# EAGLE design ekg-aio (EAGLE 5.10)
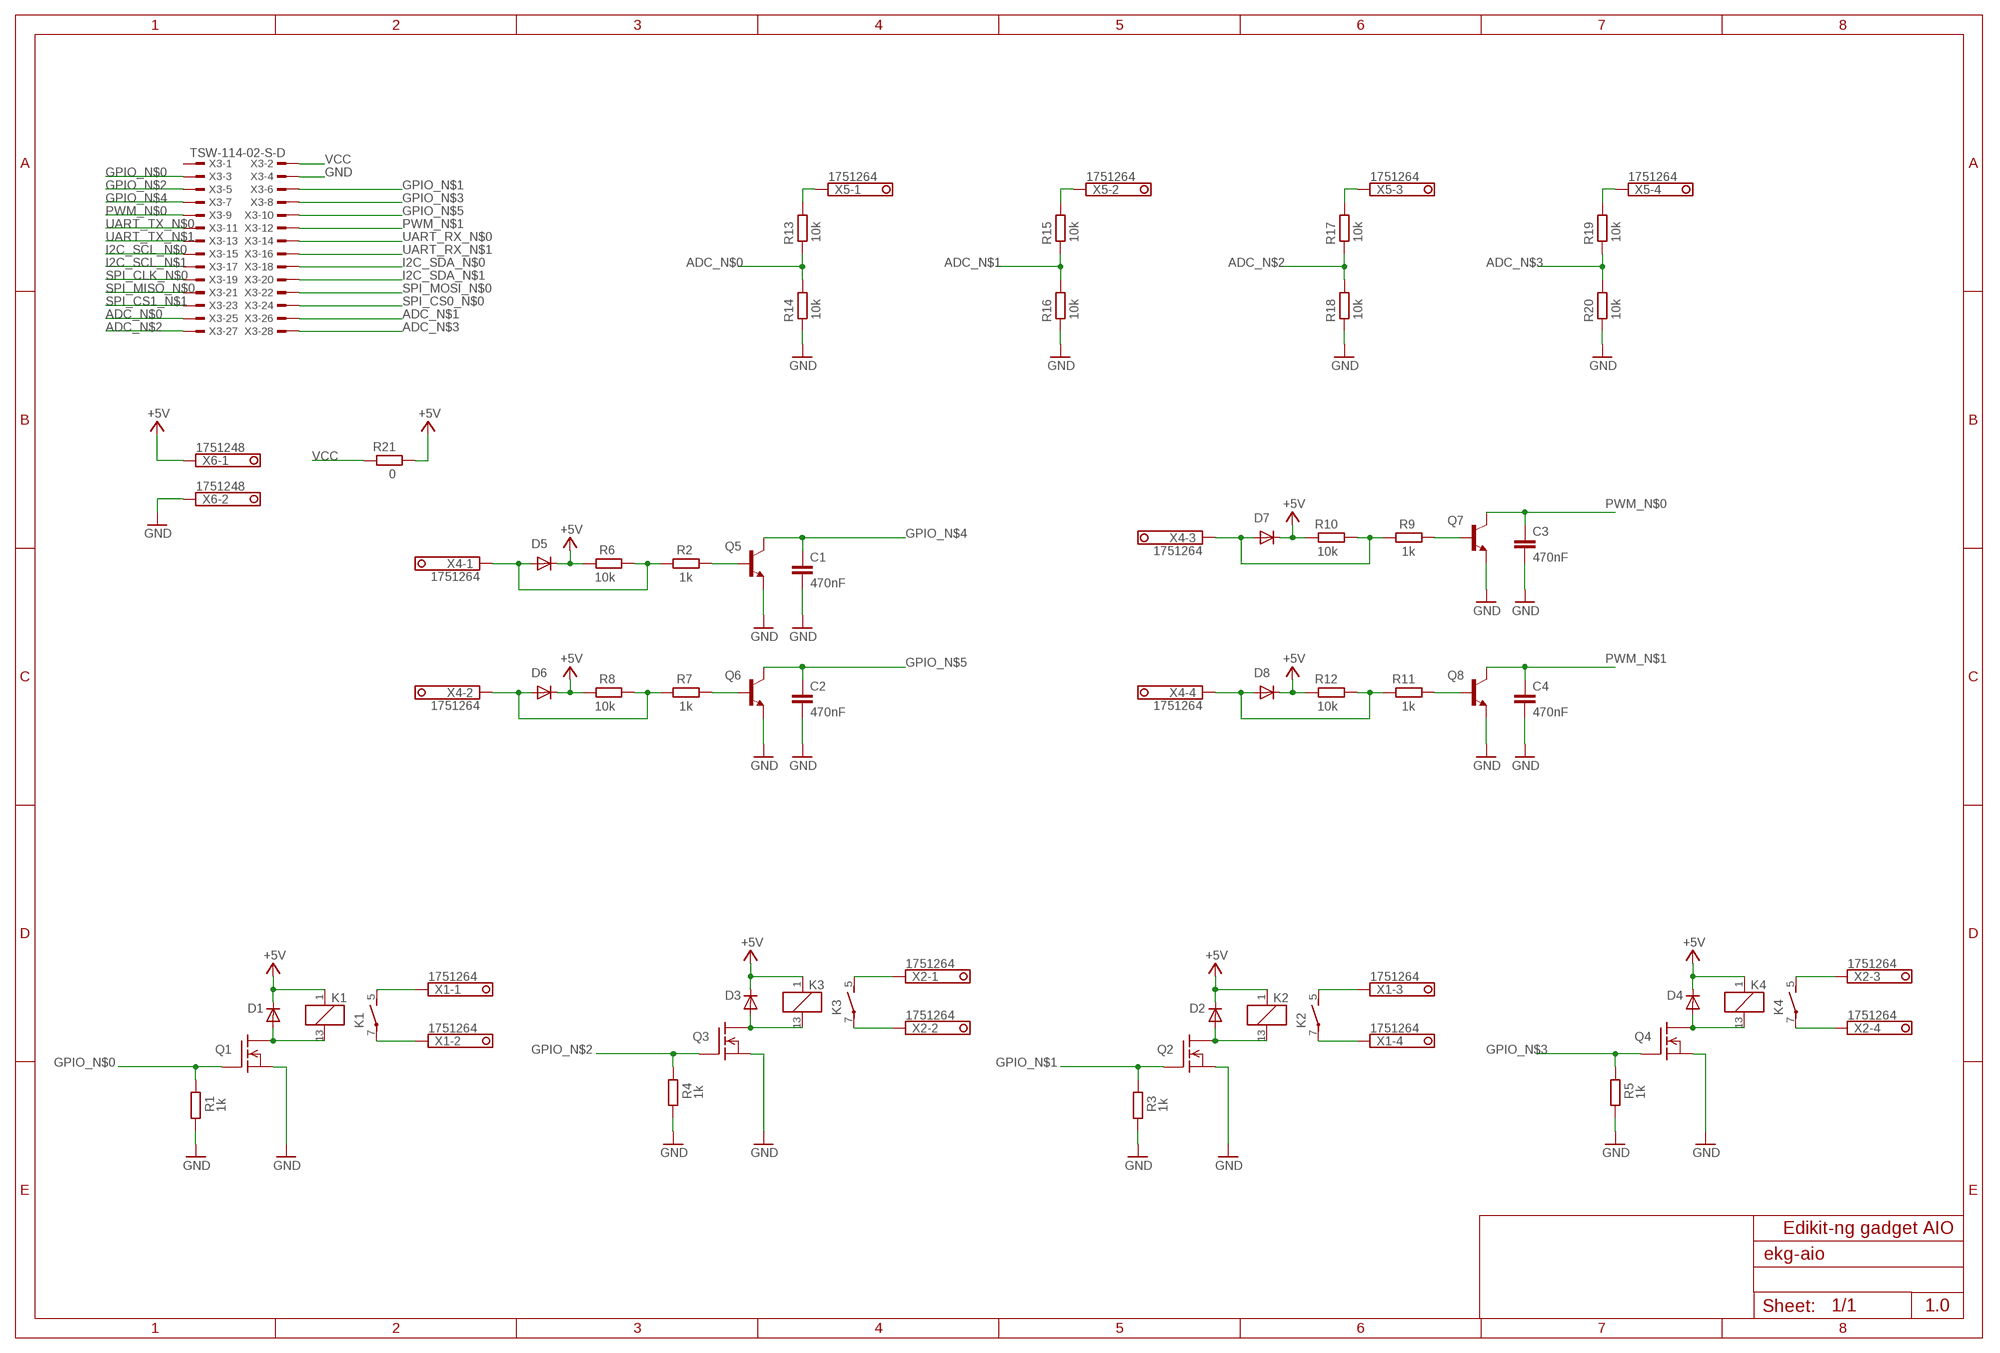
[diagram p0: schematic, sheet 1]

## Parts
C1  470nF  C-EUC0805  [C0805]
C2  470nF  C-EUC0805  [C0805]
C3  470nF  C-EUC0805  [C0805]
C4  470nF  C-EUC0805  [C0805]
D1  1N41480805  [0805]
D2  1N41480805  [0805]
D3  1N41480805  [0805]
D4  1N41480805  [0805]
D5  1N41480805  [0805]
D6  1N41480805  [0805]
D7  1N41480805  [0805]
D8  1N41480805  [0805]
K1  G6D-04P  [G6D-1A]
K2  G6D-04P  [G6D-1A]
K3  G6D-04P  [G6D-1A]
K4  G6D-04P  [G6D-1A]
Q1  BSS138  [SOT23]
Q2  BSS138  [SOT23]
Q3  BSS138  [SOT23]
Q4  BSS138  [SOT23]
Q5  BC817-40SMD  [SOT23-BEC]
Q6  BC817-40SMD  [SOT23-BEC]
Q7  BC817-40SMD  [SOT23-BEC]
Q8  BC817-40SMD  [SOT23-BEC]
R1  1k  R-EU_R1206  [R1206]
R2  1k  R-EU_R1206  [R1206]
R3  1k  R-EU_R1206  [R1206]
R4  1k  R-EU_R1206  [R1206]
R5  1k  R-EU_R1206  [R1206]
R6  10k  R-EU_R1206  [R1206]
R7  1k  R-EU_R1206  [R1206]
R8  10k  R-EU_R1206  [R1206]
R9  1k  R-EU_R1206  [R1206]
R10  10k  R-EU_R1206  [R1206]
R11  1k  R-EU_R1206  [R1206]
R12  10k  R-EU_R1206  [R1206]
R13  10k  R-EU_R1206  [R1206]
R14  10k  R-EU_R1206  [R1206]
R15  10k  R-EU_R1206  [R1206]
R16  10k  R-EU_R1206  [R1206]
R17  10k  R-EU_R1206  [R1206]
R18  10k  R-EU_R1206  [R1206]
R19  10k  R-EU_R1206  [R1206]
R20  10k  R-EU_R1206  [R1206]
R21  0  R-EU_R1206  [R1206]
X1  1751264  [1751264]
X2  1751264  [1751264]
X3  TSW-114-02-S-D  [TSW-114-02-S-D]
X4  1751264  [1751264]
X5  1751264  [1751264]
X6  1751248  [1751248]

## Nets
+5V: D1.2(C) D2.2(C) D3.2(C) D4.2(C) D5.2(C) D6.2(C) D7.2(C) D8.2(C) K1.1 K2.1 K3.1 K4.1 R6.2 R8.2 R10.2 R12.2 R21.1 X6.1
ADC_N$0: R13.2 R14.1 X3.25
ADC_N$1: R15.2 R16.1 X3.26
ADC_N$2: R17.2 R18.1 X3.27
ADC_N$3: R19.2 R20.1 X3.28
GND: C1.2 C2.2 C3.2 C4.2 Q1.2(S) Q2.2(S) Q3.2(S) Q4.2(S) Q5.E Q6.E Q7.E Q8.E R1.1 R3.1 R4.1 R5.1 R14.2 R16.2 R18.2 R20.2 X3.4 X6.2
GPIO_N$0: Q1.1(G) R1.2 X3.3
GPIO_N$1: Q2.1(G) R3.2 X3.6
GPIO_N$2: Q3.1(G) R4.2 X3.5
GPIO_N$3: Q4.1(G) R5.2 X3.8
GPIO_N$4: C1.1 Q5.C X3.7
GPIO_N$5: C2.1 Q6.C X3.10
I2C_SCL_N$0: X3.15
I2C_SCL_N$1: X3.17
I2C_SDA_N$0: X3.18
I2C_SDA_N$1: X3.20
N$1: Q5.B R2.1
N$2: D1.1(A) K1.13 Q1.3(D)
N$3: Q6.B R7.1
N$4: D2.1(A) K2.13 Q2.3(D)
N$5: K1.5(2:S) X1.1
N$6: K1.7(2:P) X1.2
N$7: K2.5(2:S) X1.3
N$8: K2.7(2:P) X1.4
N$9: Q7.B R9.1
N$10: D3.1(A) K3.13 Q3.3(D)
N$11: K3.5(2:S) X2.1
N$12: K3.7(2:P) X2.2
N$13: D7.1(A) R9.2 R10.1 X4.3
N$14: D4.1(A) K4.13 Q4.3(D)
N$15: K4.5(2:S) X2.3
N$16: K4.7(2:P) X2.4
N$17: Q8.B R11.1
N$18: D8.1(A) R11.2 R12.1 X4.4
N$19: D5.1(A) R2.2 R6.1 X4.1
N$20: D6.1(A) R7.2 R8.1 X4.2
N$21: R13.1 X5.1
N$22: R15.1 X5.2
N$23: R17.1 X5.3
N$24: R19.1 X5.4
PWM_N$0: C3.1 Q7.C X3.9
PWM_N$1: C4.1 Q8.C X3.12
SPI_CLK_N$0: X3.19
SPI_CS0_N$0: X3.24
SPI_CS1_N$1: X3.23
SPI_MISO_N$0: X3.21
SPI_MOSI_N$0: X3.22
UART_RX_N$0: X3.14
UART_RX_N$1: X3.16
UART_TX_N$0: X3.11
UART_TX_N$1: X3.13
VCC: R21.2 X3.2
Unconnected: X3.1

## Notes on the sheet
- Edikit-ng gadget AIO
- 1.0

## Library data of the parts
C1-C4 = resistor:C-EU: CAPACITOR, European symbol
D1-D8 = design:1N4148: DIODE high speed (Philips)
K1-K4 = design:G6D?*: OMRON Slim, Miniature PCB Relay 20 × 5.08 × 12.5 mm
Q1-Q4 = design:BSS138: N-Channel Enhancement MOSFET 50V; 0,22A
Q5-Q8 = transistor-npn:BC817*: NPN Transistor
R1-R21 = resistor:R-EU_: RESISTOR, European symbol
X1 X2 X4 X5 = con-phoenix-350:1751264: MKDS 1/ 4-3,5 Printklemme Nennstrom: 10 A Bemessungsspannung: 160 V Raster: 3,5 mm Polzahl: 4 Montageart: Löten Anschlussart: Schraubanschluss Anschlussrichtung vom Leiter zur Platine: 0° Source: http://eshop.phoenixcontact.com .. 1751264.pdf
X3 = con-samtec:TSW-114-02-S-D: THROUGH-HOLE .025" SQ POST HEADER Source: Samtec TSW.pdf
X6 = con-phoenix-350:1751248: MKDS 1/ 2-3,5 Printklemme Nennstrom: 10 A Bemessungsspannung: 160 V Raster: 3,5 mm Polzahl: 2 Montageart: Löten Anschlussart: Schraubanschluss Anschlussrichtung vom Leiter zur Platine: 0° Source: http://eshop.phoenixcontact.com .. 1751248.pdf

## Board
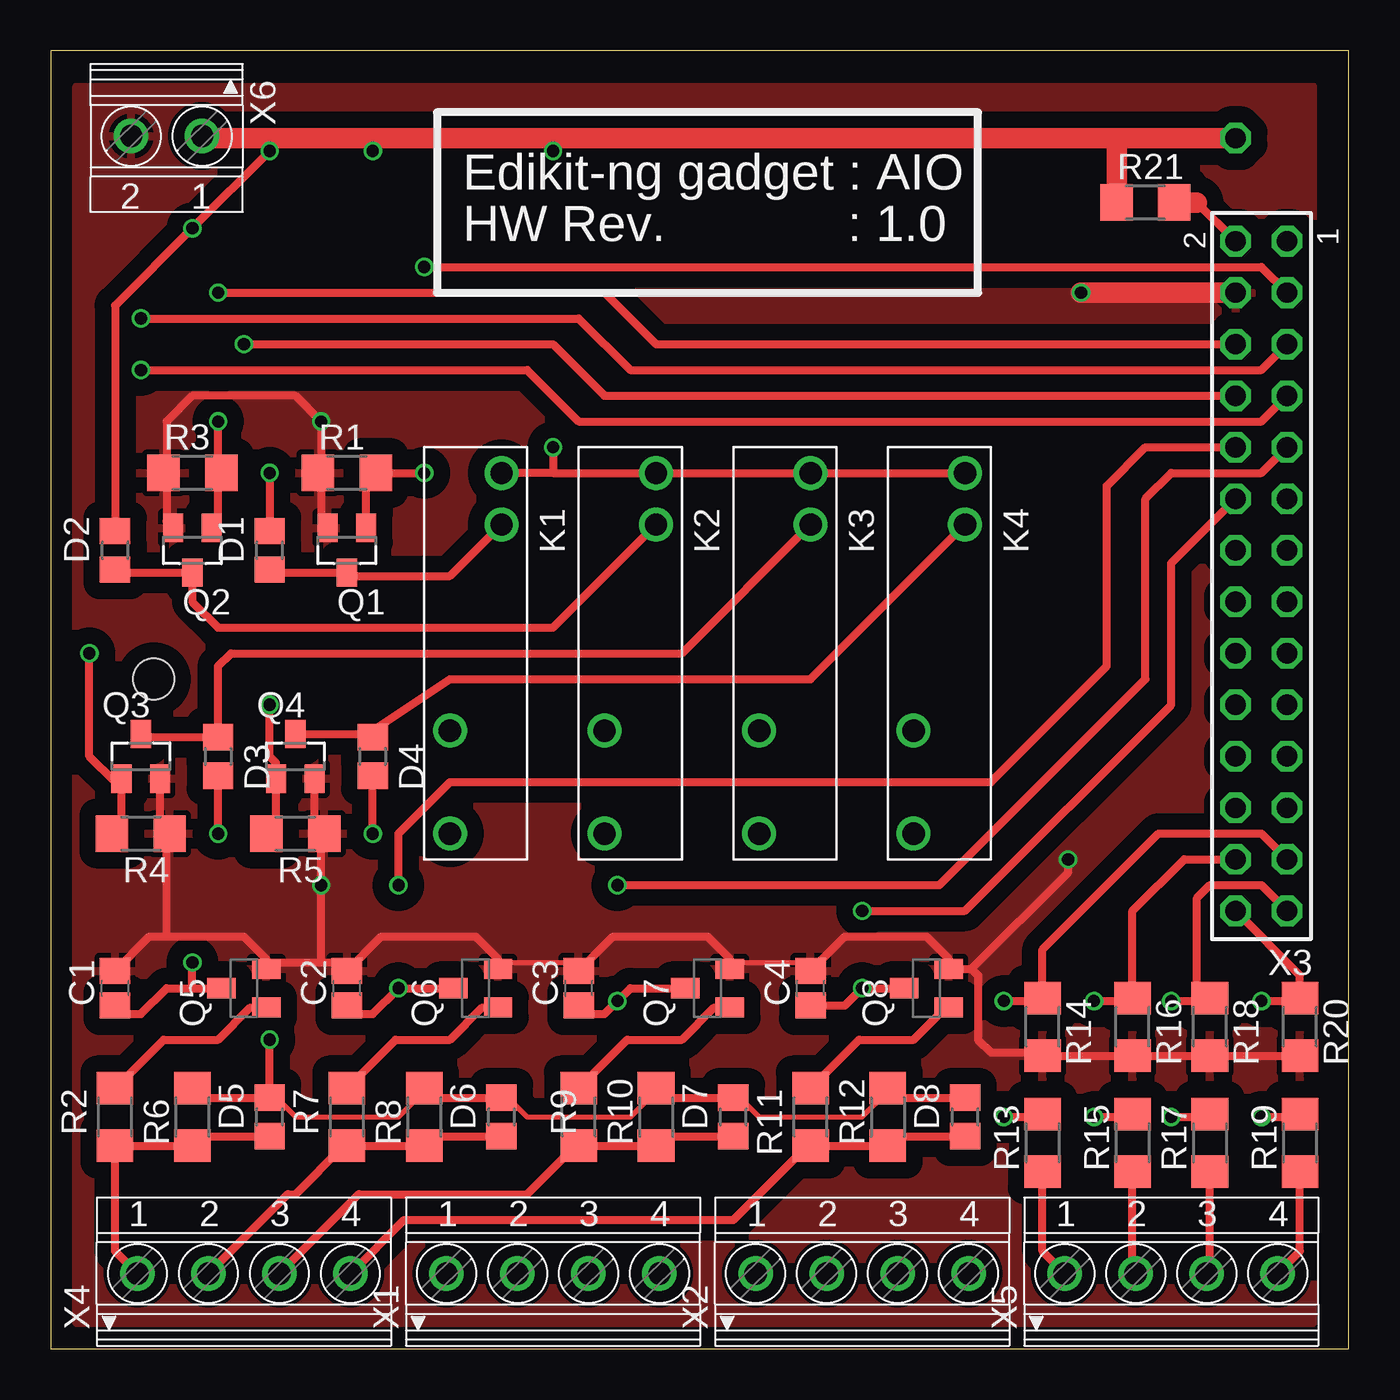
[diagram p1: board, top side]
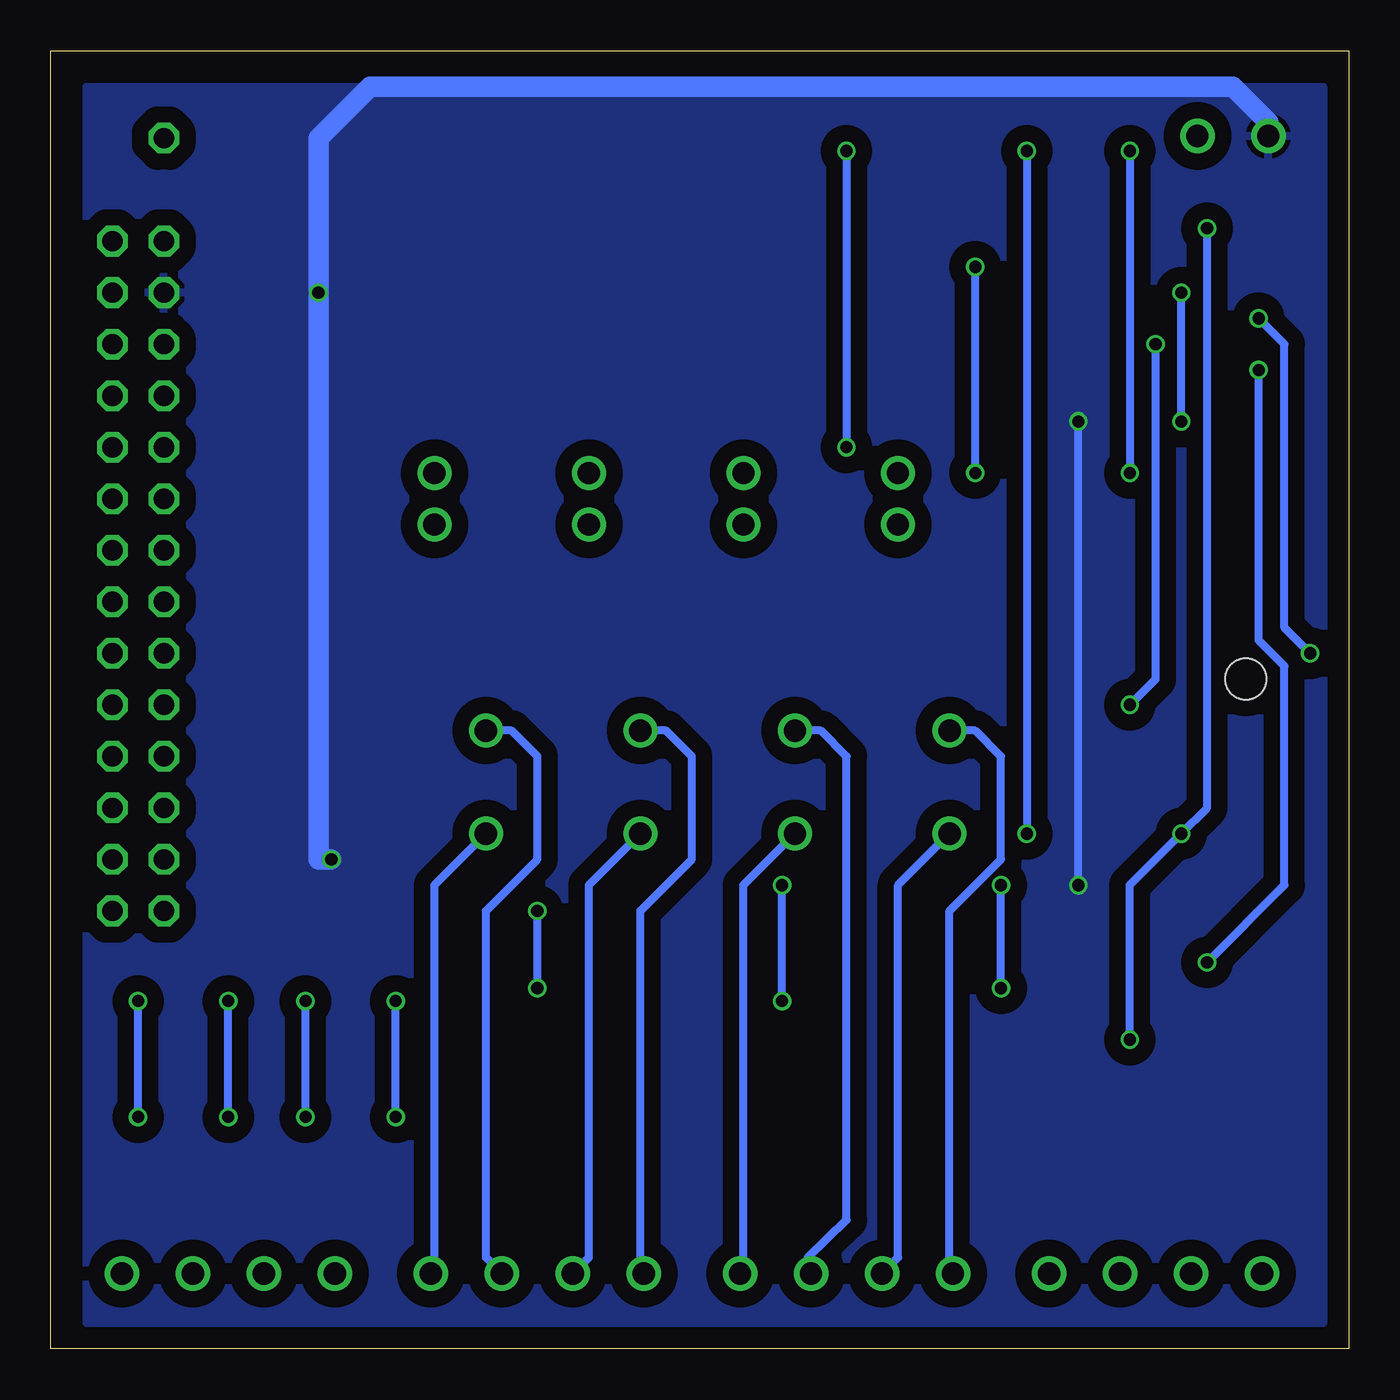
[diagram p2: board, bottom side, seen from below]

Size 64 x 64 mm. Coordinates in mm from the lower left corner, seen from the top.
Outline: 0,0 64,0 64,64 0,64 0,0
Copper layers (1*16): Top 0.035mm / dielectric 1.5mm / Bottom 0.035mm
Design rules "ITeadStudio": minimum track width 6mil, minimum drill 12mil, track to track 6mil, track to pad 6mil, pad to pad 6mil, via to via 6mil, smd to smd 0mil, copper to edge 10mil, drill to drill 10mil, minimum pad ring 10mil, minimum via ring 6mil, stop-mask expansion 2mil, vias tented up to drill 100mil, thermal gap 10mil
Holes 2 mm at 5.08,33.02

### Footprints (pad centres in the part's own frame; a part is rotated, then mirrored left to right if it is on the bottom)
C0805 = smd 1.3 x 1.5: 1 -0.85,0; 2 0.85,0
0805 = smd 1.3 x 1.5: 1 -0.95,0; 2 0.95,0
G6D-1A = drill 1.1 pad 1.676 round: 1 -8.89,1.27; 5 3.81,-1.27; 7 8.89,-1.27; 13 -6.35,1.27
SOT23 = smd 1 x 1.4: 1 -0.95,-1.1; 2 0.95,-1.1; 3 0,1.1
SOT23-BEC = smd 1 x 1.4: B -0.95,-1.1; C 0,1.1; E 0.95,-1.1
R1206 = smd 1.6 x 1.803: 1 -1.422,0; 2 1.422,0
1751264 = drill 1.1 pad 1.7 round: 1 -5.25,-0.1; 2 -1.75,-0.1; 3 1.75,-0.1; 4 5.25,-0.1
TSW-114-02-S-D = drill 1 pad 1.5 octagon: 1 16.51,-1.27; 2 16.51,1.27; 3 13.97,-1.27; 4 13.97,1.27; 5 11.43,-1.27; 6 11.43,1.27; 7 8.89,-1.27; 8 8.89,1.27; 9 6.35,-1.27; 10 6.35,1.27; 11 3.81,-1.27; 12 3.81,1.27; 13 1.27,-1.27; 14 1.27,1.27; 15 -1.27,-1.27; 16 -1.27,1.27; 17 -3.81,-1.27; 18 -3.81,1.27; 19 -6.35,-1.27; 20 -6.35,1.27; 21 -8.89,-1.27; 22 -8.89,1.27; 23 -11.43,-1.27; 24 -11.43,1.27; 25 -13.97,-1.27; 26 -13.97,1.27; 27 -16.51,-1.27; 28 -16.51,1.27
1751248 = drill 1.1 pad 1.7 round: 1 -1.75,-0.1; 2 1.75,-0.1

### Placement (x,y rotation side)
C1  3.17,17.78 90 top
C2  14.61,17.78 90 top
C3  26.04,17.78 90 top
C4  37.47,17.78 90 top
D1  10.79,39.37 90 top
D2  3.17,39.37 90 top
D3  8.26,29.21 270 top
D4  15.88,29.21 270 top
D5  10.79,11.43 90 top
D6  22.23,11.43 90 top
D7  33.66,11.43 90 top
D8  45.09,11.43 90 top
K1  20.95,34.29 270 top
K2  28.57,34.29 270 top
K3  36.2,34.29 270 top
K4  43.81,34.29 270 top
Q1  14.61,39.37 180 top
Q2  6.99,39.37 180 top
Q3  4.45,29.21 0 top
Q4  12.06,29.21 0 top
Q5  9.53,17.78 90 top
Q6  20.95,17.78 90 top
Q7  32.38,17.78 90 top
Q8  43.18,17.78 90 top
R1  14.61,43.18 0 top
R2  3.17,11.43 270 top
R3  6.99,43.18 0 top
R4  4.45,25.4 180 top
R5  12.06,25.4 180 top
R6  6.99,11.43 90 top
R7  14.61,11.43 270 top
R8  18.41,11.43 90 top
R9  26.04,11.43 270 top
R10  29.84,11.43 90 top
R11  37.47,11.43 270 top
R12  41.27,11.43 90 top
R13  48.9,10.16 90 top
R14  48.9,15.88 270 top
R15  53.34,10.16 90 top
R16  53.34,15.88 270 top
R17  57.15,10.16 90 top
R18  57.15,15.88 270 top
R19  61.59,10.16 90 top
R20  61.59,15.88 270 top
R21  53.98,56.52 0 top
X1  24.77,3.81 0 top
X2  40.01,3.81 0 top
X3  59.69,38.1 90 top
X4  9.53,3.81 0 top
X5  55.24,3.81 0 top
X6  5.71,59.69 180 top

### Tracks (layer width: path | path; a pad name or v marks a point on that pad's centre or on a via)
+5V  (via drill 0.6, 1)
  Top 0.254: D5.2 10.79,12.7 12.06,11.43 17.14,11.43 18.41,12.7 R8.2 | D7.2 33.66,12.7 34.92,11.43 40.01,11.43 41.27,12.7 R12.2 | D6.2 22.23,12.7 23.5,11.43 28.57,11.43 29.84,12.7 R10.2
  Top 0.406: R6.2 7.46,12.38 D5.2 v10.79,15.24 | D6.2 18.89,12.38 R8.2 | D7.2 30.32,12.38 R10.2 | D8.2 41.75,12.38 R12.2 | 24.77,43.18 K2.1 K3.1 K4.1 | v10.79,43.18 D1.2 | 10.79,59.69 v10.79,59.05 v6.99,55.24 3.17,51.44 D2.2 | 24.77,43.18 K1.1 | v24.77,44.45 24.77,43.18 | 24.77,59.69 v24.77,59.05 | v8.26,25.4 D3.2 | v15.88,25.4 D4.2 | 15.88,59.69 v15.88,59.05 | 52.07,59.69 52.55,59.21
  Top 1.016: X6.1 7.52,59.79 7.62,59.69 10.79,59.69 15.88,59.69 24.77,59.69 52.07,59.69 v58.42,59.69 | 52.55,59.21 R21.1
  Bottom 0.406: v10.79,59.05 v10.79,43.18 | v24.77,59.05 v24.77,44.45 | v6.99,55.24 6.99,26.67 v8.26,25.4 10.79,22.86 v10.79,15.24 | v15.88,59.05 v15.88,25.4
ADC_N$0  (via drill 0.6)
  Top 0.406: X3.25 59.69,25.4 54.61,25.4 48.9,19.68 R14.1 48.9,17.14 v46.99,17.14 | v46.99,11.43 48.74,11.43 R13.2
  Bottom 0.406: v46.99,11.43 v46.99,17.14
ADC_N$1  (via drill 0.6)
  Top 0.406: X3.26 55.88,24.13 53.34,21.59 R16.1 53.34,17.14 v51.44,17.14 | v51.44,11.43 53.19,11.43 R15.2
  Bottom 0.406: v51.44,11.43 v51.44,17.14
ADC_N$2  (via drill 0.6)
  Top 0.406: X3.27 59.69,22.86 57.15,22.86 56.52,22.23 56.52,17.93 R18.1 57.15,17.14 v55.24,17.14 | v55.24,11.43 57,11.43 R17.2
  Bottom 0.406: v55.24,11.43 v55.24,17.14
ADC_N$3  (via drill 0.6)
  Top 0.406: X3.28 61.59,18.41 R20.1 61.59,17.14 v59.69,17.14 | v59.69,11.43 61.44,11.43 R19.2
  Bottom 0.406: v59.69,11.43 v59.69,17.14
GND  (via drill 0.6)
  Top 0.254: 5.71,25.4 R4.1 | Q5.E 10.79,19.05 | 14.61,19.05 C2.2 | C3.2 26.04,19.05 22.23,19.05 Q6.E | Q7.E 33.66,19.05 37.47,19.05 C4.2
  Top 0.406: Q3.2 5.39,25.87 R4.1 | Q4.2 13.02,25.87 R5.1 13.34,25.4 v13.34,22.86 13.34,19.05 | Q5.E 10.62,19.22 9.53,20.32 5.71,20.32 | 5.71,20.32 4.87,20.32 C1.2 | Q6.E 22.05,19.22 20.95,20.32 16.3,20.32 C2.2 | Q7.E 33.48,19.22 32.38,20.32 27.73,20.32 C3.2 | C4.2 39.16,20.32 43.18,20.32 44.28,19.22 Q8.E 45.4,18.73 | 5.71,20.32 5.71,25.4 | 13.34,19.05 14.61,19.05 | 10.79,19.05 13.34,19.05 | 45.4,18.73 50.16,23.5 v50.16,24.13 | 13.34,43.18 13.34,40.79 Q1.2 | 5.71,43.18 5.71,40.79 Q2.2 | 5.71,43.18 R3.1 | 5.71,43.18 5.71,45.72 6.99,46.99 12.06,46.99 v13.34,45.72 13.34,43.18 | 13.34,43.18 R1.1 | R20.2 R18.2 R16.2 R14.2 48.41,14.45 48.26,14.61 46.35,14.61 45.72,15.24 45.72,18.41 45.41,18.73 45.4,18.73
  Top 1.016: v50.8,52.07 X3.4
  Bottom 0.406: v13.34,22.86 v13.34,45.72
  Bottom 1.016: v50.16,24.13 50.8,24.13 v50.8,52.07 50.8,59.69 48.26,62.23 5.71,62.23 3.96,60.48 X6.2
  pour Top (isolate 0.813): 1.27,62.23 62.23,62.23 62.23,1.27 1.27,1.27
  pour Bottom (isolate 0.813): 1.27,62.23 1.27,1.27 62.23,1.27 62.23,62.23
GPIO_N$0  (via drill 0.6)
  Top 0.406: Q1.1 15.55,42.71 R1.2 v18.41,43.18 | X3.3 59.69,53.34 v18.41,53.34
  Bottom 0.406: v18.41,43.18 v18.41,53.34
GPIO_N$1  (via drill 0.6)
  Top 0.406: Q2.1 7.93,40.64 8.26,40.64 8.26,43.18 R3.2 8.26,43.33 v8.26,45.72 | v8.26,52.07 27.3,52.07 29.84,49.53 X3.6
  Bottom 0.406: v8.26,45.72 v8.26,52.07
GPIO_N$2  (via drill 0.6)
  Top 0.406: R4.2 3.5,25.87 Q3.1 3.33,27.94 3.17,27.94 1.91,29.21 v1.91,34.29 | X3.5 59.69,48.26 28.57,48.26 26.04,50.8 v4.45,50.8
  Bottom 0.406: v4.45,50.8 3.17,49.53 3.17,35.56 v1.91,34.29
GPIO_N$3  (via drill 0.6)
  Top 0.406: R5.2 11.12,25.87 Q4.1 11.12,28.89 10.79,29.21 v10.79,31.75 | v9.53,49.53 24.77,49.53 27.3,46.99 X3.8
  Bottom 0.406: v10.79,31.75 9.53,33.02 v9.53,49.53
GPIO_N$4  (via drill 0.6)
  Top 0.406: 6.99,17.78 5.71,17.78 4.45,16.51 3.6,16.51 C1.1 | 6.99,17.78 Q5.C | X3.7 59.69,45.72 26.04,45.72 23.5,48.26 v4.45,48.26 | 6.99,17.78 v6.99,19.05
  Bottom 0.406: v6.99,19.05 3.17,22.86 3.17,33.66 4.45,34.92 v4.45,48.26
GPIO_N$5  (via drill 0.6)
  Top 0.406: Q6.C v17.14,17.78 15.88,16.51 15.03,16.51 C2.1 | X3.10 53.98,44.45 52.07,42.55 52.07,33.66 46.35,27.94 19.68,27.94 17.14,25.4 v17.14,22.86
  Bottom 0.406: v17.14,17.78 v17.14,22.86
N$1
  Top 0.406: Q5.B 9.85,16.83 8.26,15.24 5.56,15.24 R2.1
N$2
  Top 0.406: D1.1 10.79,38.27 Q1.3 14.61,38.1 19.68,38.1 K1.13
N$3
  Top 0.406: Q6.B 21.27,16.83 19.68,15.24 16.99,15.24 R7.1
N$4
  Top 0.406: D2.1 3.17,38.27 Q2.3 6.99,36.83 8.26,35.56 24.77,35.56 K2.13
N$5
  Bottom 0.406: K1.5 18.41,30.48 17.14,29.21 17.14,24.13 19.68,21.59 19.68,3.88 X1.1
N$6
  Bottom 0.406: K1.7 22.23,22.86 22.23,4.5 X1.2
N$7
  Bottom 0.406: K2.5 26.04,30.48 24.77,29.21 24.77,6.35 26.67,4.5 X1.3
N$8
  Bottom 0.406: K2.7 29.84,22.86 29.84,3.88 X1.4
N$9
  Top 0.406: Q7.B 32.7,16.83 31.11,15.24 28.42,15.24 R9.1
N$10
  Top 0.406: Q3.3 4.59,30.16 D3.1 8.26,33.66 8.89,34.29 31.11,34.29 K3.13
N$11
  Bottom 0.406: K3.5 33.66,30.48 32.38,29.21 32.38,24.13 34.92,21.59 34.92,3.88 X2.1
N$12
  Bottom 0.406: K3.7 37.47,22.86 37.47,4.5 X2.2
N$13
  Top 0.406: D7.1 30.32,10.48 R10.1 R9.2 25.88,10.01 23.5,7.62 15.19,7.62 X4.3
N$14
  Top 0.406: Q4.3 15.72,30.31 D4.1 15.88,30.48 19.68,33.02 37.47,33.02 K4.13
N$15
  Bottom 0.406: K4.5 41.27,30.48 40.01,29.21 40.01,24.13 42.55,21.59 42.55,4.5 X2.3
N$16
  Bottom 0.406: K4.7 45.09,22.86 45.09,3.88 X2.4
N$17
  Top 0.406: Q8.B 44.13,16.83 42.55,15.24 39.85,15.24 R11.1
N$18
  Top 0.406: D8.1 41.75,10.48 R12.1 R11.2 37.31,10.01 33.66,6.35 17.41,6.35 X4.4
N$19
  Top 0.406: D5.1 7.46,10.48 R6.1 R2.2 3.17,4.81 X4.1
N$20
  Top 0.406: D6.1 18.89,10.48 R8.1 R7.2 14.45,10.01 12.06,7.62 11.69,7.62 X4.2
N$21
  Top 0.406: R13.1 48.9,4.81 X5.1
N$22
  Top 0.406: R15.1 53.34,3.87 X5.2
N$23
  Top 0.406: R17.1 57.15,3.87 X5.3
N$24
  Top 0.406: R19.1 61.59,4.81 X5.4
PWM_N$0  (via drill 0.6)
  Top 0.406: Q7.C 28.57,17.78 v27.94,17.14 27.3,16.51 26.45,16.51 C3.1 | X3.9 59.69,43.18 55.24,43.18 53.98,41.91 53.98,33.02 43.81,22.86 v27.94,22.86
  Bottom 0.406: v27.94,17.14 v27.94,22.86
PWM_N$1  (via drill 0.6)
  Top 0.406: X3.12 55.24,38.73 55.24,31.75 45.09,21.59 v40.01,21.59 | C4.1 39.16,16.93 v40.01,17.78 Q8.C
  Bottom 0.406: v40.01,17.78 v40.01,21.59
VCC
  Top 0.406: 56.52,56.52 X3.2
  Top 1.016: R21.2 56.52,56.52

### Text on the board
tNames: Edikit-ng gadget : AIO | HW Rev. : 1.0